# EAGLE design TKX90001 - STRATASYS (EAGLE 9.1.3)
Agregar buzzer, conectores hembra
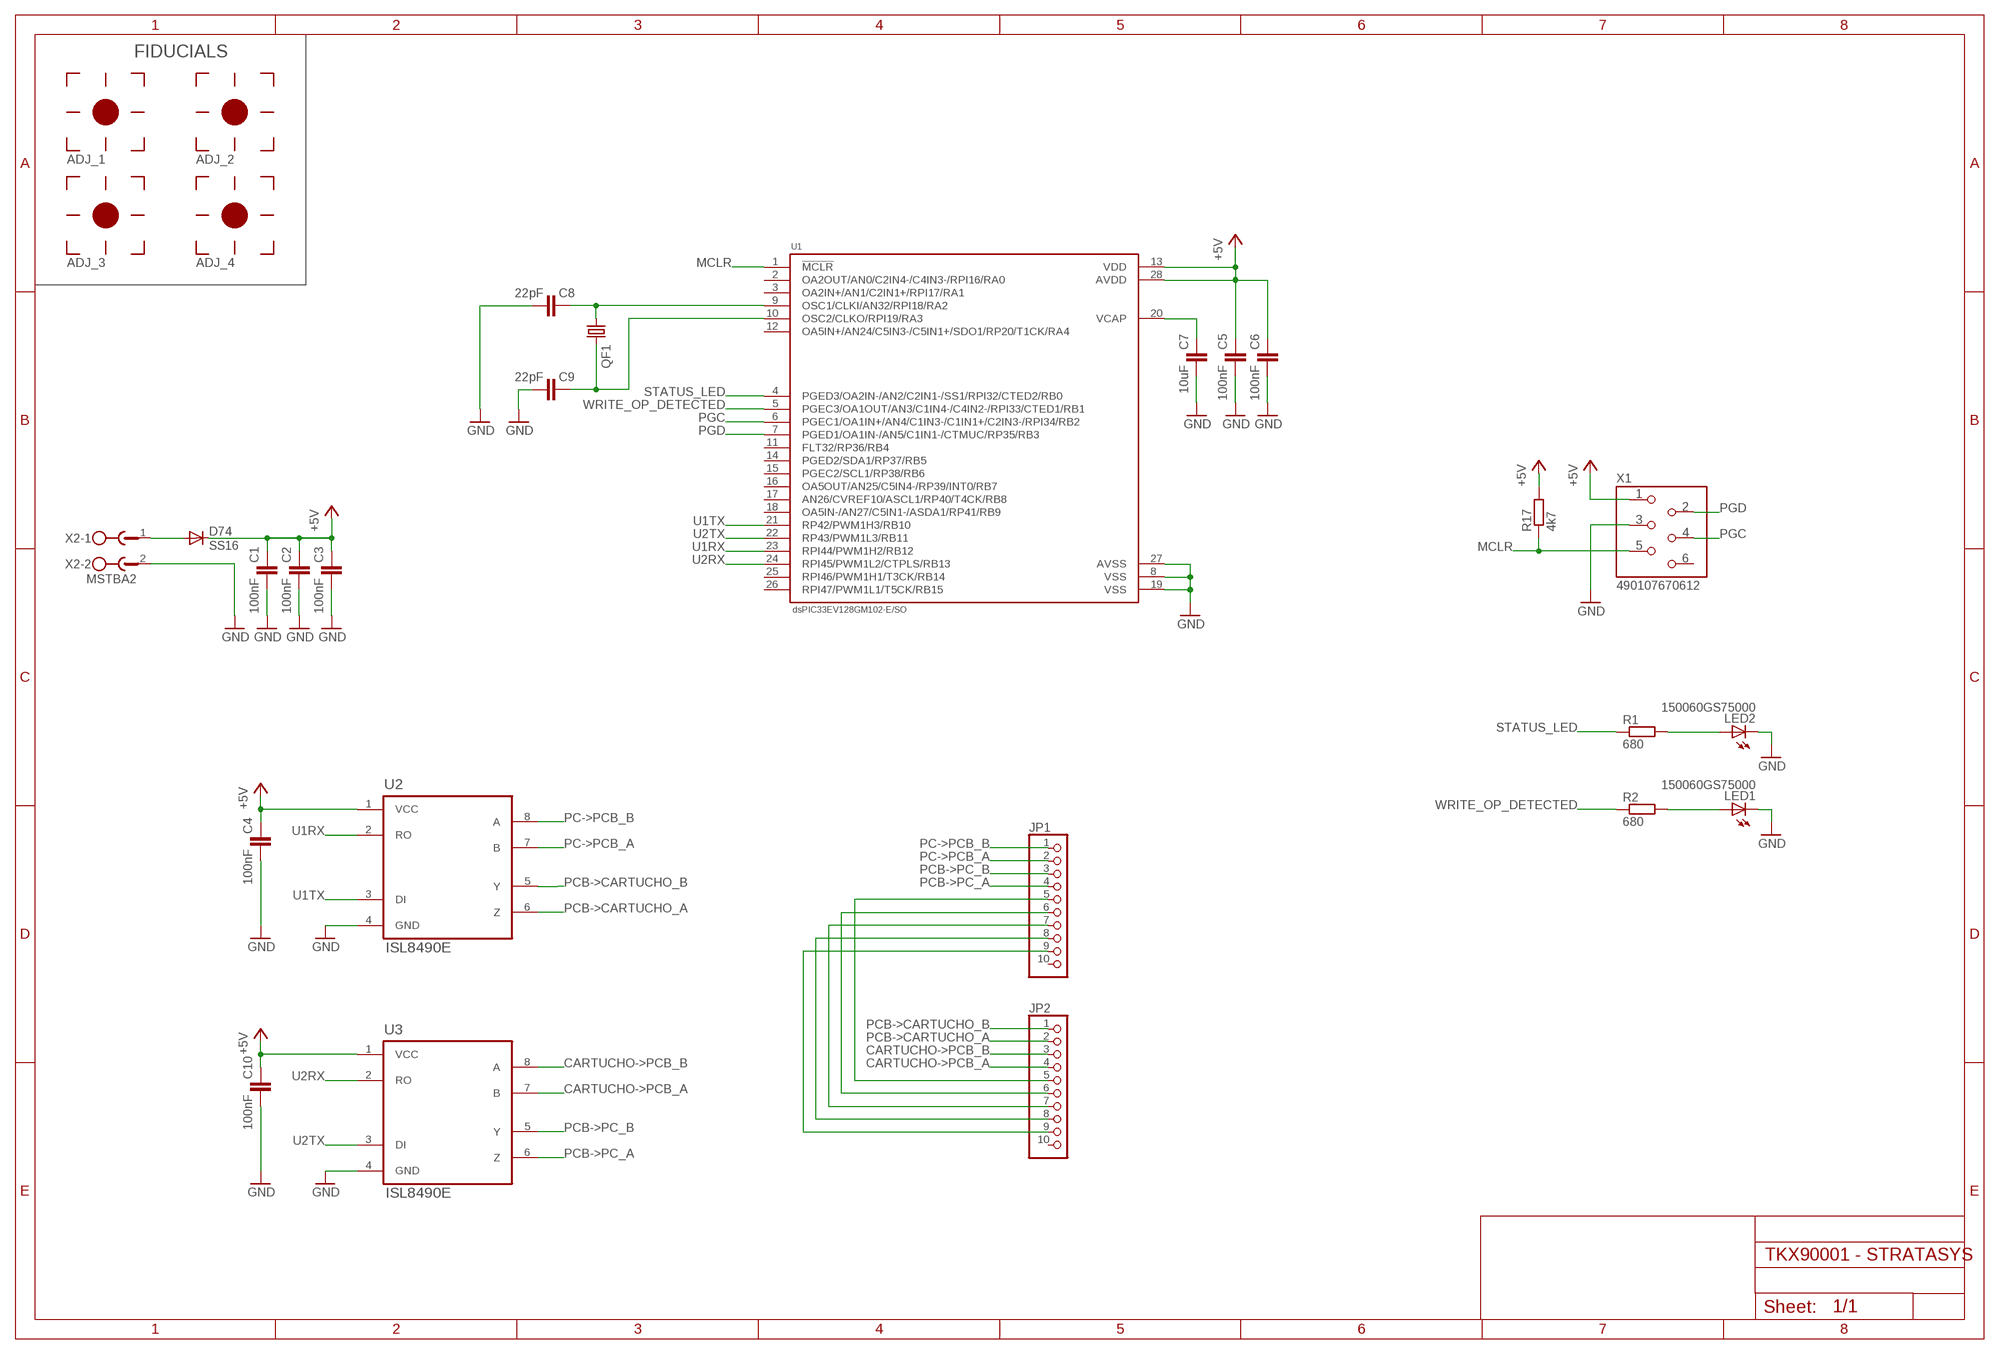
[diagram p0: schematic, sheet 1]

## Parts
ADJ_1  FIDUCIAL  [FIDUCIAL]
ADJ_2  FIDUCIAL  [FIDUCIAL]
ADJ_3  FIDUCIAL  [FIDUCIAL]
ADJ_4  FIDUCIAL  [FIDUCIAL]
C1  100nF  C-EUC0603K  [C0603K]
C2  100nF  C-EUC0603K  [C0603K]
C3  100nF  C-EUC0603K  [C0603K]
C4  100nF  C-EUC0603K  [C0603K]
C5  100nF  C-EUC0603K  [C0603K]
C6  100nF  C-EUC0603K  [C0603K]
C7  10uF  C-EUC1206K  [C1206K]
C8  22pF  C-EUC0603K  [C0603K]
C9  22pF  C-EUC0603K  [C0603K]
C10  100nF  C-EUC0603K  [C0603K]
D74  SS16  DIODE-SMB  [SMB]
JP1  PINHD-1X10/90  [1X10/90]
JP2  PINHD-1X10/90  [1X10/90]
LED1  150060GS75000  LEDSML0603  [SML0603]
LED2  150060GS75000  LEDSML0603  [SML0603]
QF1  CRYSTALHC49S  [HC49/S]
R1  680  R-EU_R0603  [R0603]
R2  680  R-EU_R0603  [R0603]
R17  4k7  R-EU_R0603  [R0603]
U1  dsPIC33EV128GM102-E/SO  DSPIC33EV128GM104-E/PT  [SOIC127P1028X256-28N]
U2  ISL8490E  [SOIC127P600X175-8N]
U3  ISL8490E  [SOIC127P600X175-8N]
X1  490107670612  REDFIT_6POS  [REDFIT_6POS]
X2  MSTBA2  [MSTBA2]

## Nets
+5V: C1.1 C2.1 C3.1 C4.1 C5.1 C6.1 C10.1 D74.C R17.2 U1.13(VDD) U1.28(AVDD) U2.1(VCC) U3.1(VCC) X1.P$1
CARTUCHO->PCB_A: JP2.4 U3.7(B)
CARTUCHO->PCB_B: JP2.3 U3.8(A)
GND: C1.2 C2.2 C3.2 C4.2 C5.2 C6.2 C7.2 C8.2 C9.2 C10.2 LED1.C LED2.C U1.8(VSS) U1.19(VSS) U1.27(AVSS) U2.4(GND) U3.4(GND) X1.P$3 X2.2
MCLR: R17.1 U1.1(!MCLR) X1.P$5
N$1: LED1.A R2.2
N$2: D74.A X2.1
N$15: C7.1 U1.20(VCAP)
N$17: C8.1 QF1.1 U1.9(OSC1/CLKI/AN32/RPI18/RA2)
N$18: LED2.A R1.2
N$19: C9.1 QF1.2 U1.10(OSC2/CLKO/RPI19/RA3)
N$22: JP1.5 JP2.5
N$23: JP1.6 JP2.6
N$24: JP1.7 JP2.7
N$25: JP1.8 JP2.8
N$26: JP1.9 JP2.9
PC->PCB_A: JP1.2 U2.7(B)
PC->PCB_B: JP1.1 U2.8(A)
PCB->CARTUCHO_A: JP2.2 U2.6(Z)
PCB->CARTUCHO_B: JP2.1 U2.5(Y)
PCB->PC_A: JP1.4 U3.6(Z)
PCB->PC_B: JP1.3 U3.5(Y)
PGC: U1.6(PGEC1/OA1IN+/AN4/C1IN3-/C1IN1+/C2IN3-/RPI34/RB2) X1.P$4
PGD: U1.7(PGED1/OA1IN-/AN5/C1IN1-/CTMUC/RP35/RB3) X1.P$2
STATUS_LED: R1.1 U1.4(PGED3/OA2IN-/AN2/C2IN1-/SS1/RPI32/CTED2/RB0)
U1RX: U1.23(RPI44/PWM1H2/RB12) U2.2(RO)
U1TX: U1.21(RP42/PWM1H3/RB10) U2.3(DI)
U2RX: U1.24(RPI45/PWM1L2/CTPLS/RB13) U3.2(RO)
U2TX: U1.22(RP43/PWM1L3/RB11) U3.3(DI)
WRITE_OP_DETECTED: R2.1 U1.5(PGEC3/OA1OUT/AN3/C1IN4-/C4IN2-/RPI33/CTED1/RB1)
Unconnected: JP1.10 JP2.10 U1.2(OA2OUT/AN0/C2IN4-/C4IN3-/RPI16/RA0) U1.3(OA2IN+/AN1/C2IN1+/RPI17/RA1) U1.11(FLT32/RP36/RB4) U1.12(OA5IN+/AN24/C5IN3-/C5IN1+/SDO1/RP20/T1CK/RA4) U1.14(PGED2/SDA1/RP37/RB5) U1.15(PGEC2/SCL1/RP38/RB6) U1.16(OA5OUT/AN25/C5IN4-/RP39/INT0/RB7) U1.17(AN26/CVREF10/ASCL1/RP40/T4CK/RB8) U1.18(OA5IN-/AN27/C5IN1-/ASDA1/RP41/RB9) U1.25(RPI46/PWM1H1/T3CK/RB14) U1.26(RPI47/PWM1L1/T5CK/RB15) X1.P$6

## Notes on the sheet
- FIDUCIALS

## Library data of the parts
ADJ_1-ADJ_4 = XMC4700_Relax-V1:FIDUCIAL; BOM: EXCLUDE; FIDUCIAL: 1
C1-C6 C10 = rcl:C-EU: CAPACITOR, European symbol; PARTNO: 885012206020
C7 = rcl:C-EU: CAPACITOR, European symbol; PARTNO: TAJA106K016RNJV; SPICEPREFIX: C
C8 = rcl:C-EU: CAPACITOR, European symbol; PARTNO: C0603C220M4RACAUTO; SPICEPREFIX: C
C9 = rcl:C-EU: CAPACITOR, European symbol; PARTNO: C0603C220M4RACAUTO
D74 = diode:DIODE-: DIODE; PARTNO: SS16T3G
JP1 JP2 = pinhead:PINHD-1X10: PIN HEADER
LED1 LED2 = led:LED: LED OSRAM: - CHIPLED LG R971, LG N971, LY N971, LG Q971, LY Q971, LO R971, LY R971 LH N974, LH R974 LS Q976, LO Q976, LY Q976 LO Q996 - Hyper CHIPLED LW Q18S LB Q993, LB Q99A, LB R99A - SideLED LS A670, LO A670, LY A670, LG A670, LP A670 LB A673, LV A673, LT A673, LW A673 LH A674 LY A675 LS A676, LA A676, LO A676, LY A676, LW A676 LS A679, LY A679, LG A679 - Hyper Micro SIDELED® LS Y876, LA Y876, LO Y876, LY Y876 LT Y87S - SmartLED LW L88C, LW L88S LB L89C, LB L89S, LG L890 LS L89K, LO L89K, LY L89K LS L896, LA L896, LO L896, LY L896 - TOPLED LS T670, LO T670, LY T670, LG T670, LP T670 LSG T670, LSP T670, LSY T670, LOP T670, LYG T670 LG T671, LOG T671, LSG T671 LB T673, LV T673, LT T673, LW T673 LH T674 LS T676, LA T676, LO T676, LY T676, LB T676, LH T676, LSB T676, LW T676 LB T67C, LV T67C, LT T67C, LS T67K, LO T67K, LY T67K, LW E67C LS E67B, LA E67B, LO E67B, LY E67B, LB E67C, LV E67C, LT E67C LW T67C LS T679, LY T679, LG T679 LS T770, LO T770, LY T770, LG T770, LP T770 LB T773, LV T773, LT T773, LW T773 LH T774 LS E675, LA E675, LY E675, LS T675 LS T776, LA T776, LO T776, LY T776, LB T776 LHGB T686 LT T68C, LB T68C - Hyper Mini TOPLED® LB M676 - Mini TOPLED Santana® LG M470 LS M47K, LO M47K, LY M47K Source: http://www.osram.convergy.de LUXEON: - LUMILED® LXK2-PW12-R00, LXK2-PW12-S00, LXK2-PW14-U00, LXK2-PW14-V00 LXK2-PM12-R00, LXK2-PM12-S00, LXK2-PM14-U00 LXK2-PE12-Q00, LXK2-PE12-R00, LXK2-PE12-S00, LXK2-PE14-T00, LXK2-PE14-U00 LXK2-PB12-K00, LXK2-PB12-L00, LXK2-PB12-M00, LXK2-PB14-N00, LXK2-PB14-P00, LXK2-PB14-Q00 LXK2-PR12-L00, LXK2-PR12-M00, LXK2-PR14-Q00, LXK2-PR14-R00 LXK2-PD12-Q00, LXK2-PD12-R00, LXK2-PD12-S00 LXK2-PH12-R00, LXK2-PH12-S00 LXK2-PL12-P00, LXK2-PL12-Q00, LXK2-PL12-R00 Source: www.luxeon.com KINGBRIGHT: KA-3528ASYC Source: www.kingbright.com; PARTNO: 150060GS75000
QF1 = crystal:CRYSTAL: CRYSTAL; OC_FARNELL: 1667008; OC_NEWARK: unknown
R1 R2 = rcl:R-EU_: RESISTOR, European symbol; PARTNO: RC0603FR-13680RL; SPICEPREFIX: R
R17 = rcl:R-EU_: RESISTOR, European symbol; PARTNO: RC0603FR-074K7L; SPICEPREFIX: R
U1 = DSPIC33EV128GM104-E_PT:DSPIC33EV128GM104-E/PT: 16 Bit 5V DSC 128KB ECC Flash 8KB RAM CAN 6 MC PWM 4 Op Amps CTMU; PARTNO: dsPIC33EV128GM102-E/SO
U2 U3 = ISL8490:ISL8490E; PARTNO: ISL8490EIBZ
X1 = wurth:REDFIT_6POS; BOM: EXCLUDE
X2 = con-phoenix-508:MSTBA2: PHOENIX; DNP: T; MF: FARNELL; MPN: 1757242; OC_FARNELL: 3705171; OC_NEWARK: 71C4161

## Board
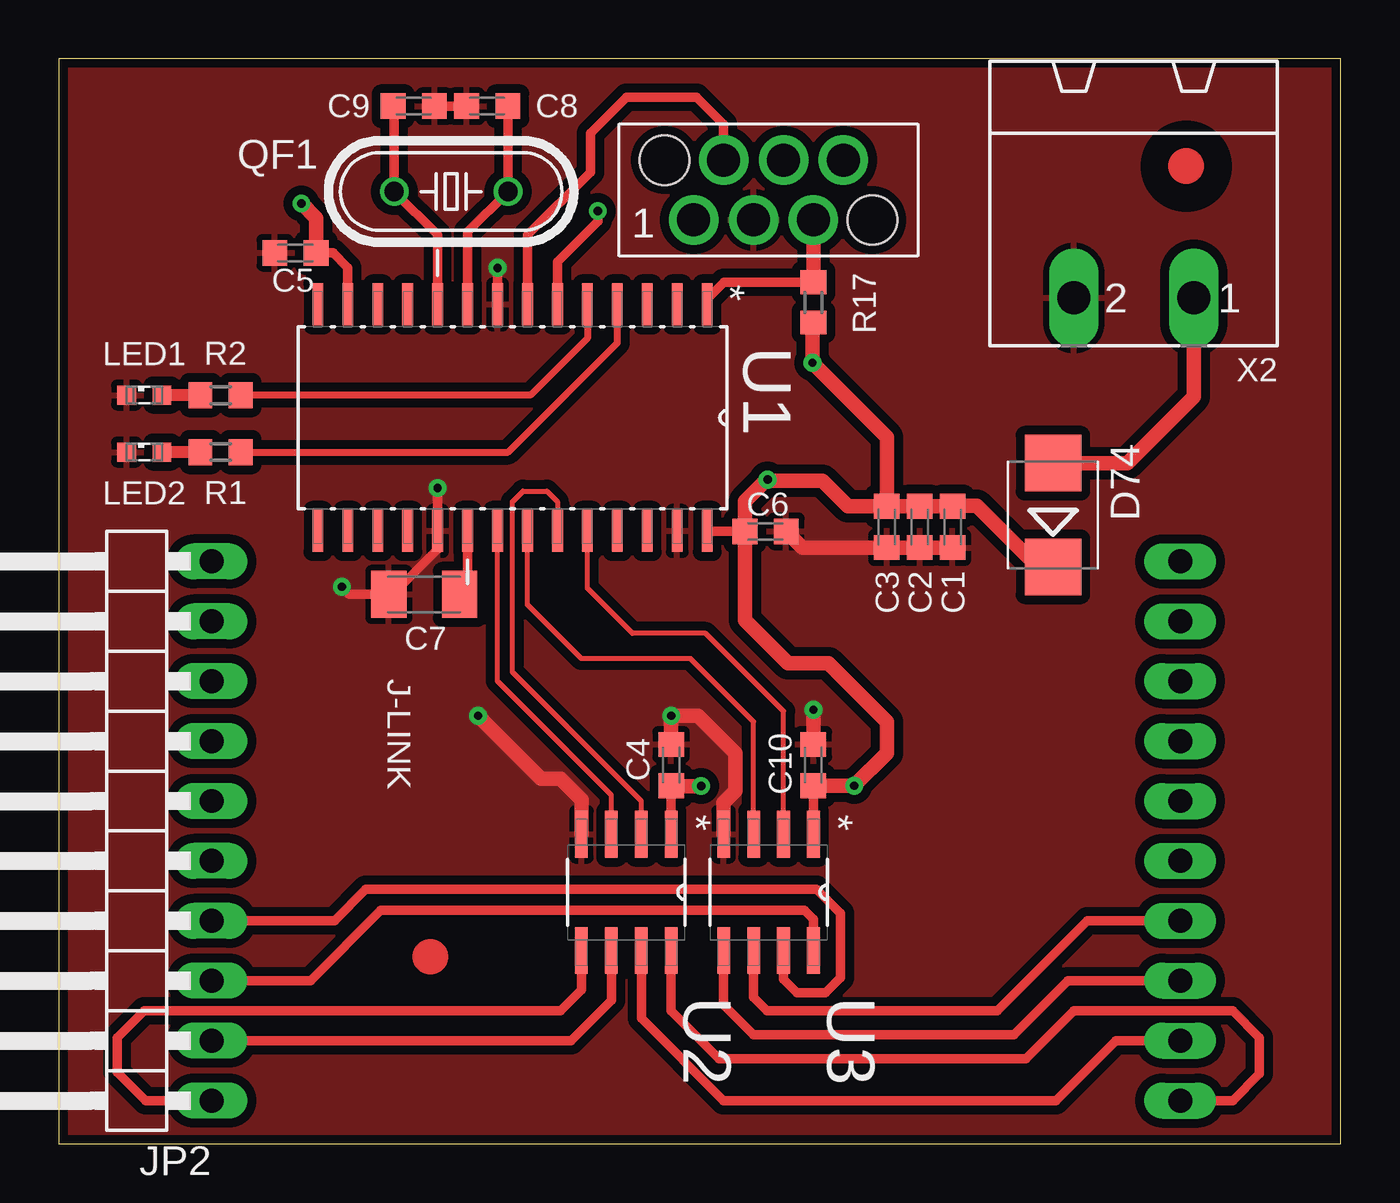
[diagram p1: board, top side]
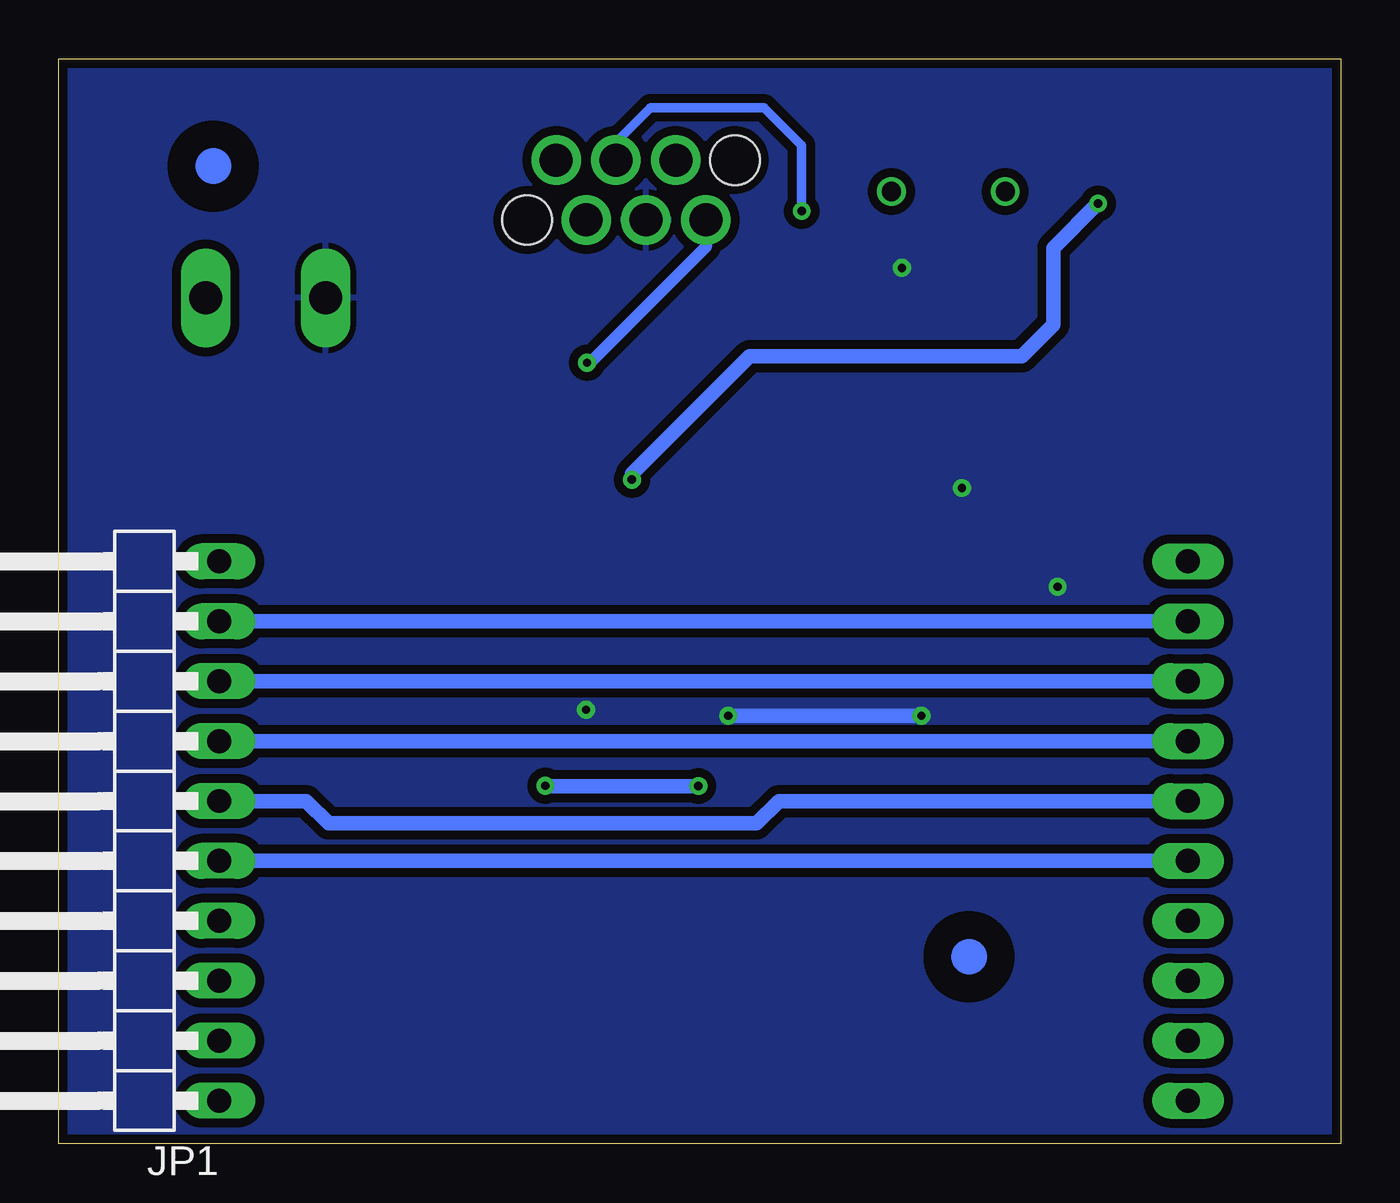
[diagram p2: board, bottom side, seen from below]

Size 54.36 x 46.01 mm. Coordinates in mm from the lower left corner, seen from the top.
Outline: 0,0 54.36,0 54.36,46.01 0,46.01 0,0
Copper layers (1*16): Top 0.035mm / dielectric 0.5mm / Bottom 0.035mm
Design rules "teknix_2l": minimum track width 8mil, minimum drill 11mil, track to track 7mil, track to pad 7mil, pad to pad 7mil, via to via 7mil, smd to smd 7mil, copper to edge 8mil, drill to drill 6mil, minimum pad ring 8mil, minimum via ring 8mil, stop-mask expansion 4mil, vias tented up to drill 25mil, thermal gap 10mil

### Footprints (pad centres in the part's own frame; a part is rotated, then mirrored left to right if it is on the bottom)
C0603K = smd 1.05 x 1.08: 1 -0.875,0; 2 0.875,0
C1206K = smd 1.5 x 2: 1 -1.5,0; 2 1.5,0
SMB = smd 2.4 x 2.4: A 2.2,0; C -2.2,0
1X10/90 = drill 1.016 long: 1 -11.43,-3.81; 2 -8.89,-3.81; 3 -6.35,-3.81; 4 -3.81,-3.81; 5 -1.27,-3.81; 6 1.27,-3.81; 7 3.81,-3.81; 8 6.35,-3.81; 9 8.89,-3.81; 10 11.43,-3.81
SML0603 = smd 0.8 x 0.8: A 0.75,0; C -0.75,0
HC49/S = drill 0.813: 1 -2.413,0; 2 2.413,0
R0603 = smd 1 x 1.1: 1 -0.85,0; 2 0.85,0
SOIC127P1028X256-28N = smd 1.778 x 0.457: 1 -4.801,8.255; 2 -4.801,6.985; 3 -4.801,5.715; 4 -4.801,4.445; 5 -4.801,3.175; 6 -4.801,1.905; 7 -4.801,0.635; 8 -4.801,-0.635; 9 -4.801,-1.905; 10 -4.801,-3.175; 11 -4.801,-4.445; 12 -4.801,-5.715; 13 -4.801,-6.985; 14 -4.801,-8.255; 15 4.801,-8.255; 16 4.801,-6.985; 17 4.801,-5.715; 18 4.801,-4.445; 19 4.801,-3.175; 20 4.801,-1.905; 21 4.801,-0.635; 22 4.801,0.635; 23 4.801,1.905; 24 4.801,3.175; 25 4.801,4.445; 26 4.801,5.715; 27 4.801,6.985; 28 4.801,8.255
SOIC127P600X175-8N = smd 1.981 x 0.533: 1 -2.464,1.905; 2 -2.464,0.635; 3 -2.464,-0.635; 4 -2.464,-1.905; 5 2.464,-1.905; 6 2.464,-0.635; 7 2.464,0.635; 8 2.464,1.905
REDFIT_6POS = drill 1.4: P$1 0,0; P$2 -1.27,-2.54; P$3 -2.54,0; P$4 -3.81,-2.54; P$5 -5.08,0; P$6 -6.35,-2.54 | hole 2.1: -7.58,0; 1.23,-2.54
MSTBA2 = drill 1.397 long: 1 -2.54,5.08; 2 2.54,5.08

### Placement (x,y rotation side)
ADJ_1  47.82,41.47 270 top
ADJ_2  15.76,7.94 270 top
ADJ_3  47.82,41.47 90 bottom
ADJ_4  15.76,7.94 90 bottom
C1  37.91,26.16 270 top
C2  36.51,26.16 270 top
C3  35.12,26.16 270 top
C4  25.97,16.07 90 top
C5  10.03,37.78 180 top
C6  29.97,25.97 0 top
C7  15.49,23.3 180 top
C8  18.16,44.01 180 top
C9  15.05,44.01 0 top
C10  32,16.07 90 top
D74  42.16,26.67 90 top
JP1  51.37,13.27 90 bottom
JP2  2.67,13.27 90 top
LED1  3.62,31.75 0 top
LED2  3.62,29.34 0 top
QF1  16.64,40.39 180 top
R1  6.86,29.34 180 top
R2  6.86,31.75 180 top
R17  32,35.69 270 top
U1  19.24,30.8 270 top
U2  24.07,10.67 270 top
U3  30.1,10.67 270 top
X1  26.92,39.18 180 top
X2  45.59,40.96 180 top

### Tracks (layer width: path | path; a pad name or v marks a point on that pad's centre or on a via)
+5V  (via drill 0.35)
  Top 0.406: U2.1 C4.1 | U3.1 C10.1 | C6.1 27.52,25.97 U1.28 | U1.13 12.26,37.15 11.62,37.78 C5.1
  Top 0.61: C3.1 C2.1 C1.1 37.92,27.05 38.95,27.05 41.53,24.47 D74.C | C3.1 35.12,29.97 v31.96,33.12 31.96,34.8 R17.2 | 29.97,28.13 30.04,28.19 v30.06,28.17 | 29.97,28.13 32.38,28.13 33.48,27.04 C3.1 | v10.29,39.88 10.91,39.26 C5.1 | v27.24,15.18 25.98,15.18 C4.1 | C10.1 v33.73,15.19 35.12,16.57 35.12,17.91 32.64,20.38 30.92,20.38 29.1,22.21 C6.1 29.1,27.26 29.97,28.13
  Bottom 0.508: X1.P$1 26.92,38.04 31.88,33.08 31.96,33.08 v31.96,33.12
  Bottom 0.61: v30.06,28.17 30.06,28.42 25.08,33.4 13.53,33.4 12.19,34.73 12.19,37.97 v10.29,39.88 | v27.24,15.18 33.72,15.18 v33.73,15.19
CARTUCHO->PCB_A
  Top 0.406: JP2.4 11.68,9.46 13.02,10.79 32.13,10.79 33.15,9.78 33.15,7.05 32.51,6.41 31.3,6.41 30.73,6.99 U3.7
CARTUCHO->PCB_B
  Top 0.406: JP2.3 10.67,6.92 13.65,9.91 29.84,9.91 31.62,9.91 32,9.53 U3.8
GND  (via drill 0.35)
  Top 0.406: C9.2 C8.2 | v12,23.62 12.32,23.3 C7.2 14.16,23.3 16.07,25.21 U1.19 v16.07,27.81 | U1.8 v18.61,37.15
  Top 0.61: C1.2 C2.2 C3.2 31.53,25.29 C6.2 | C4.2 v25.97,18.16 27.11,18.16 28.7,16.57 28.7,14.99 28.19,14.48 U3.4 | C10.2 v32,18.41 | v17.78,18.16 20.45,15.49 21.27,15.49 22.16,14.61 U2.4
  Bottom 0.61: v25.97,18.16 v17.78,18.16
  pour Top (isolate 0.381): 0,46.01 54.36,46.01 54.36,0 0,0
  pour Bottom (isolate 0.381): 0,46.01 54.36,46.01 54.36,0 0,0
MCLR
  Top 0.406: R17.1 28.22,36.54 27.5,35.81 U1.1
  Top 0.61: R17.1 X1.P$5
N$1
  Top 0.508: R2.2 LED1.A
N$2
  Top 0.61: D74.A 45.32,28.87 48.13,31.69 X2.1
N$15
  Top 0.406: U1.20 17.34,23.65 C7.1
N$17
  Top 0.406: U1.9 17.34,38.67 QF1.1 19.05,43.99 C8.1
N$18
  Top 0.508: R1.2 LED2.A
N$19
  Top 0.406: U1.10 16.07,38.54 QF1.2 14.22,43.96 C9.1
N$22
  Bottom 0.61: JP2.5 JP1.5
N$23
  Bottom 0.61: JP2.6 23.81,14.54 24.77,13.59 42.93,13.59 43.88,14.54 JP1.6
N$24
  Bottom 0.61: JP2.7 JP1.7
N$25
  Bottom 0.61: JP2.8 JP1.8
N$26
  Bottom 0.61: JP2.9 JP1.9
PC->PCB_A
  Top 0.406: JP1.2 44.83,4.38 42.29,1.84 28.19,1.84 24.7,5.33 U2.7
PC->PCB_B
  Top 0.406: U2.8 25.97,5.65 28,3.62 41.02,3.62 43.05,5.65 49.78,5.65 50.93,4.51 50.93,2.98 49.78,1.84 JP1.1
PCB->CARTUCHO_A
  Top 0.406: U2.6 23.43,6.1 21.72,4.38 JP2.2
PCB->CARTUCHO_B
  Top 0.406: U2.5 22.16,6.54 21.27,5.65 3.62,5.65 2.48,4.51 2.48,3.05 3.68,1.84 JP2.1
PCB->PC_A
  Top 0.406: U3.6 29.46,6.22 30.04,5.65 39.81,5.65 43.62,9.46 JP1.4
PCB->PC_B
  Top 0.406: U3.5 28.19,5.91 29.46,4.64 40.51,4.64 42.8,6.92 JP1.3
PGC  (via drill 0.35)
  Top 0.406: U1.6 21.14,37.4 22.86,39.12 v22.86,39.56
  Bottom 0.406: v22.86,39.56 22.86,42.35 24.45,43.94 29.27,43.94 30.73,42.48 X1.P$4
PGD
  Top 0.406: U1.7 19.88,38.54 22.54,41.21 22.54,42.86 24.07,44.39 27.05,44.39 28.19,43.24 X1.P$2
STATUS_LED
  Top 0.305: R1.1 19.05,29.34 23.69,33.97 U1.4
U1RX
  Top 0.203: U1.23 21.14,27.24 20.7,27.69 19.68,27.69 19.24,27.24 19.24,20 24.7,14.54 U2.2
U1TX
  Top 0.203: U2.3 23.43,14.8 18.61,19.62 U1.21
U2RX
  Top 0.203: U1.24 22.42,23.56 24.32,21.65 27.43,21.65 30.73,18.35 U3.2
U2TX
  Top 0.203: U3.3 29.46,17.91 26.8,20.57 22.16,20.57 19.88,22.86 U1.22
WRITE_OP_DETECTED
  Top 0.305: U1.5 22.42,34.16 20,31.75 R2.1

### Text on the board
tPlace: J-LINK
tDocu: +